# Altium schematic sheet 07-N100.SchDoc: KARGOBOT-TBOX-V2.0
size 513 x 386 mm; Page Create Date: March  8, 1995; Page Number: 4; Page Size: C; Page Count: 81; RevCode: A; DsnPath: C:\Users\Administrator\Desktop\123\KARGOBOT-TCU-ORIN-V1.1.DSN; SchematicName: KARGOBT-TCU-ORIN-V1.1; PageName: N100; PageSize: C; TopSchematic: True
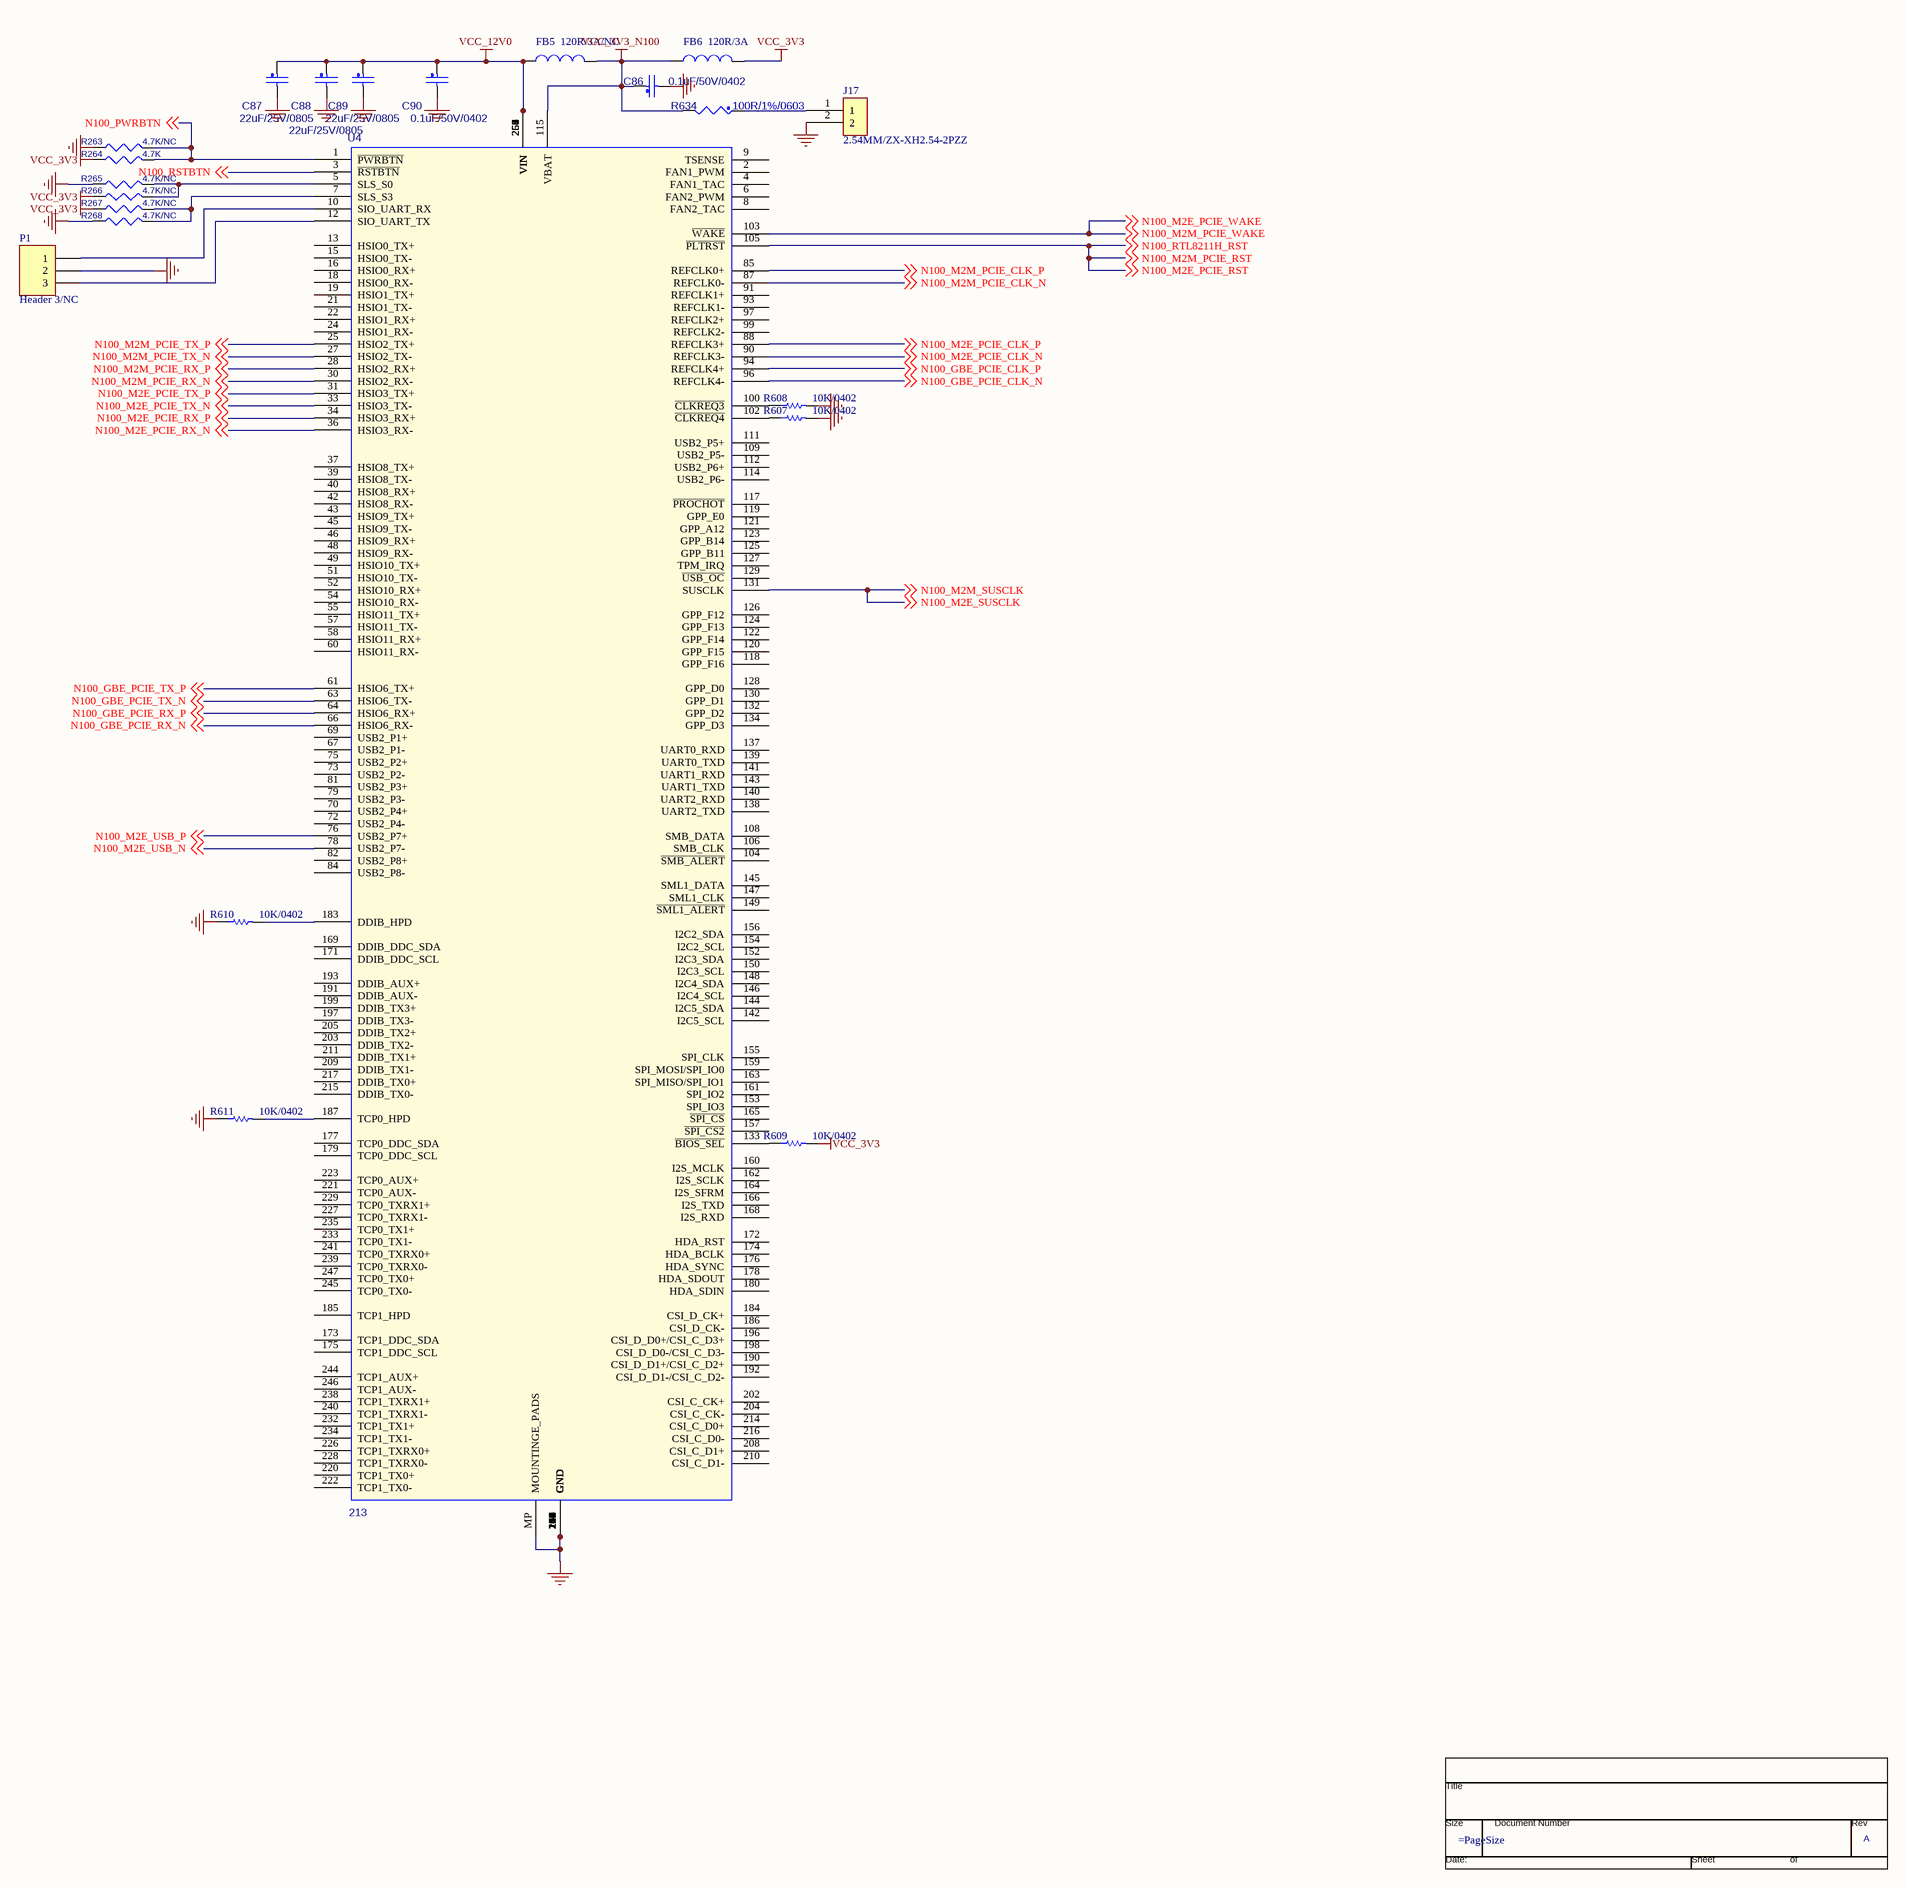
[diagram p0: 07-N100.SchDoc]

## Parts
*  RevCode: A  (graphical)
C86  value 0.1uF/50V/0402  [C0402]  (hidden comment: CAP_NP)
C87  value 22uF/25V/0805  [C0805]  (hidden comment: CAP_NP)
C88  value 22uF/25V/0805  [C0805]  (hidden comment: CAP_NP)
C89  value 22uF/25V/0805  [C0805]  (hidden comment: CAP_NP)
C90  value 0.1uF/50V/0402  [C0402]  (hidden comment: CAP_NP)
FB5  120R/3A/NC  [L0603]
FB6  120R/3A  [L0603]
J17  2.54MM/ZX-XH2.54-2PZZ  [CONN-TH_2P-P2.50_HX25003-2A]
P1  Header 3/NC  [HEADER3]
R263  value 4.7K/NC  [R0402]  (hidden comment: RESISTOR)
R264  value 4.7K  [R0402]  (hidden comment: RESISTOR)
R265  value 4.7K/NC  [R0402]  (hidden comment: RESISTOR)
R266  value 4.7K/NC  [R0402]  (hidden comment: RESISTOR)
R267  value 4.7K/NC  [R0402]  (hidden comment: RESISTOR)
R268  value 4.7K/NC  [R0402]  (hidden comment: RESISTOR)
R607  10K/0402  [R0402]
R608  10K/0402  [R0402]
R609  10K/0402  [R0402]
R610  10K/0402  [R0402]
R611  10K/0402  [R0402]
R634  value 100R/1%/0603  [R0603]  (hidden comment: RES_Dup2)
U4  value 213  [N100]  (hidden comment: N100)

## Nets
GND: C86.2 C87.2 C88.2 C89.2 C90.2 J17.2 P1.2 R263.1 R265.1 R268.1 R607.2 R608.2 R610.1 R611.1 U4.11(GND) U4.14(GND) U4.17(GND) U4.20(GND) U4.23(GND) U4.26(GND) U4.29(GND) U4.32(GND) U4.35(GND) U4.38(GND) U4.41(GND) U4.44(GND) U4.47(GND) U4.50(GND) U4.53(GND) U4.56(GND) U4.59(GND) U4.62(GND) U4.65(GND) U4.68(GND) U4.71(GND) U4.74(GND) U4.77(GND) U4.80(GND) U4.83(GND) U4.86(GND) U4.89(GND) U4.92(GND) U4.95(GND) U4.98(GND) U4.101(GND) U4.107(GND) U4.110(GND) U4.113(GND) U4.116(GND) U4.135(GND) U4.136(GND) U4.151(GND) U4.158(GND) U4.167(GND) U4.170(GND) U4.181(GND) U4.182(GND) U4.188(GND) U4.189(GND) U4.194(GND) U4.195(GND) U4.200(GND) U4.201(GND) U4.206(GND) U4.207(GND) U4.212(GND) U4.213(GND) U4.218(GND) U4.219(GND) U4.224(GND) U4.225(GND) U4.230(GND) U4.231(GND) U4.236(GND) U4.237(GND) U4.242(GND) U4.243(GND) U4.248(GND) U4.249(GND) U4.MP(MOUNTINGE_PADS)
VCC_3V3: FB6.2 R264.1 R266.1 R267.1 R609.2
VCC_3V3_N100: C86.1 FB5.2 FB6.1 R634.2 U4.115(VBAT)
VCC_12V0: C87.1 C88.1 C89.1 C90.1 FB5.1 U4.250(VIN) U4.251(VIN) U4.252(VIN) U4.253(VIN) U4.254(VIN) U4.255(VIN) U4.256(VIN) U4.257(VIN) U4.258(VIN) U4.259(VIN) U4.260(VIN)
N100_GBE_PCIE_CLK_N: U4.96(REFCLK4-) ; off-sheet N100_GBE_PCIE_CLK_N
N100_GBE_PCIE_CLK_P: U4.94(REFCLK4+) ; off-sheet N100_GBE_PCIE_CLK_P
N100_GBE_PCIE_RX_N: U4.66(HSIO6_RX-) ; off-sheet N100_GBE_PCIE_RX_N
N100_GBE_PCIE_RX_P: U4.64(HSIO6_RX+) ; off-sheet N100_GBE_PCIE_RX_P
N100_GBE_PCIE_TX_N: U4.63(HSIO6_TX-) ; off-sheet N100_GBE_PCIE_TX_N
N100_GBE_PCIE_TX_P: U4.61(HSIO6_TX+) ; off-sheet N100_GBE_PCIE_TX_P
N100_M2E_PCIE_CLK_N: U4.90(REFCLK3-) ; off-sheet N100_M2E_PCIE_CLK_N
N100_M2E_PCIE_CLK_P: U4.88(REFCLK3+) ; off-sheet N100_M2E_PCIE_CLK_P
N100_M2E_PCIE_RST: U4.105(~{PLTRST}) ; off-sheet N100_RTL8211H_RST, off-sheet N100_M2M_PCIE_RST, off-sheet N100_M2E_PCIE_RST  [also labelled N100_M2M_PCIE_RST, N100_RTL8211H_RST]
N100_M2E_PCIE_RX_N: U4.36(HSIO3_RX-) ; off-sheet N100_M2E_PCIE_RX_N
N100_M2E_PCIE_RX_P: U4.34(HSIO3_RX+) ; off-sheet N100_M2E_PCIE_RX_P
N100_M2E_PCIE_TX_N: U4.33(HSIO3_TX-) ; off-sheet N100_M2E_PCIE_TX_N
N100_M2E_PCIE_TX_P: U4.31(HSIO3_TX+) ; off-sheet N100_M2E_PCIE_TX_P
N100_M2E_PCIE_WAKE: U4.103(~{WAKE}) ; off-sheet N100_M2M_PCIE_WAKE, off-sheet N100_M2E_PCIE_WAKE  [also labelled N100_M2M_PCIE_WAKE]
N100_M2E_SUSCLK: U4.131(SUSCLK) ; off-sheet N100_M2M_SUSCLK, off-sheet N100_M2E_SUSCLK  [also labelled N100_M2M_SUSCLK]
N100_M2E_USB_N: U4.78(USB2_P7-) ; off-sheet N100_M2E_USB_N
N100_M2E_USB_P: U4.76(USB2_P7+) ; off-sheet N100_M2E_USB_P
N100_M2M_PCIE_CLK_N: U4.87(REFCLK0-) ; off-sheet N100_M2M_PCIE_CLK_N
N100_M2M_PCIE_CLK_P: U4.85(REFCLK0+) ; off-sheet N100_M2M_PCIE_CLK_P
N100_M2M_PCIE_RX_N: U4.30(HSIO2_RX-) ; off-sheet N100_M2M_PCIE_RX_N
N100_M2M_PCIE_RX_P: U4.28(HSIO2_RX+) ; off-sheet N100_M2M_PCIE_RX_P
N100_M2M_PCIE_TX_N: U4.27(HSIO2_TX-) ; off-sheet N100_M2M_PCIE_TX_N
N100_M2M_PCIE_TX_P: U4.25(HSIO2_TX+) ; off-sheet N100_M2M_PCIE_TX_P
N100_PWRBTN: R263.2 R264.2 U4.1(~{PWRBTN}) ; off-sheet N100_PWRBTN
N100_RSTBTN: U4.3(~{RSTBTN}) ; off-sheet N100_RSTBTN
NetJ17_1: J17.1 R634.1
NetP1_1: P1.1 U4.10(SIO_UART_RX)
NetP1_3: P1.3 U4.12(SIO_UART_TX)
NetR265_2: R265.2 R266.2 U4.5(SLS_S0)
NetR267_2: R267.2 R268.2 U4.7(SLS_S3)
NetR607_1: R607.1 U4.102(~{CLKREQ4})
NetR608_1: R608.1 U4.100(~{CLKREQ3})
NetR609_1: R609.1 U4.133(~{BIOS_SEL})
NetR610_2: R610.2 U4.183(DDIB_HPD)
NetR611_2: R611.2 U4.187(TCP0_HPD)

Not connected (* = marked no-connect by the designer): U4 2(FAN1_PWM) 4(FAN1_TAC) 6(FAN2_PWM) 8(FAN2_TAC) 9(TSENSE) 13(HSIO0_TX+) 15(HSIO0_TX-) 16(HSIO0_RX+) 18(HSIO0_RX-) 19(HSIO1_TX+) 21(HSIO1_TX-) 22(HSIO1_RX+) 24(HSIO1_RX-) 37(HSIO8_TX+) 39(HSIO8_TX-) 40(HSIO8_RX+) 42(HSIO8_RX-) 43(HSIO9_TX+) 45(HSIO9_TX-) 46(HSIO9_RX+) 48(HSIO9_RX-) 49(HSIO10_TX+) 51(HSIO10_TX-) 52(HSIO10_RX+) 54(HSIO10_RX-) 55(HSIO11_TX+) 57(HSIO11_TX-) 58(HSIO11_RX+) 60(HSIO11_RX-) 67(USB2_P1-) 69(USB2_P1+) 70(USB2_P4+) 72(USB2_P4-) 73(USB2_P2-) 75(USB2_P2+) 79(USB2_P3-) 81(USB2_P3+) 82(USB2_P8+) 84(USB2_P8-) 91(REFCLK1+) 93(REFCLK1-) 97(REFCLK2+) 99(REFCLK2-) 104(~{SMB_ALERT}) 106(SMB_CLK) 108(SMB_DATA) 109(USB2_P5-) 111(USB2_P5+) 112(USB2_P6+) 114(USB2_P6-) 117(~{PROCHOT}) 118(GPP_F16) 119(GPP_E0) 120(GPP_F15) 121(GPP_A12) 122(GPP_F14) 123(GPP_B14) 124(GPP_F13) 125(GPP_B11) 126(GPP_F12) 127(TPM_IRQ) 128(GPP_D0) 129(~{USB_OC}) 130(GPP_D1) 132(GPP_D2) 134(GPP_D3) 137(UART0_RXD) 138(UART2_TXD) 139(UART0_TXD) 140(UART2_RXD) 141(UART1_RXD) 142(I2C5_SCL) 143(UART1_TXD) 144(I2C5_SDA) 145(SML1_DATA) 146(I2C4_SCL) 147(SML1_CLK) 148(I2C4_SDA) 149(~{SML1_ALERT}) 150(I2C3_SCL) 152(I2C3_SDA) 153(SPI_IO3) 154(I2C2_SCL) 155(SPI_CLK) 156(I2C2_SDA) 157(~{SPI_CS2}) 159(SPI_MOSI/SPI_IO0) 160(I2S_MCLK) 161(SPI_IO2) 162(I2S_SCLK) 163(SPI_MISO/SPI_IO1) 164(I2S_SFRM) 165(~{SPI_CS}) 166(I2S_TXD) 168(I2S_RXD) 169(DDIB_DDC_SDA) 171(DDIB_DDC_SCL) 172(HDA_RST) 173(TCP1_DDC_SDA) 174(HDA_BCLK) 175(TCP1_DDC_SCL) 176(HDA_SYNC) 177(TCP0_DDC_SDA) 178(HDA_SDOUT) 179(TCP0_DDC_SCL) 180(HDA_SDIN) 184(CSI_D_CK+) 185(TCP1_HPD) 186(CSI_D_CK-) 190(CSI_D_D1+/CSI_C_D2+) 191(DDIB_AUX-) 192(CSI_D_D1-/CSI_C_D2-) 193(DDIB_AUX+) 196(CSI_D_D0+/CSI_C_D3+) 197(DDIB_TX3-) 198(CSI_D_D0-/CSI_C_D3-) 199(DDIB_TX3+) 202(CSI_C_CK+) 203(DDIB_TX2-) 204(CSI_C_CK-) 205(DDIB_TX2+) 208(CSI_C_D1+) 209(DDIB_TX1-) 210(CSI_C_D1-) 211(DDIB_TX1+) 214(CSI_C_D0+) 215(DDIB_TX0-) 216(CSI_C_D0-) 217(DDIB_TX0+) 220(TCP1_TX0+) 221(TCP0_AUX-) 222(TCP1_TX0-) 223(TCP0_AUX+) 226(TCP1_TXRX0+) 227(TCP0_TXRX1-) 228(TCP1_TXRX0-) 229(TCP0_TXRX1+) 232(TCP1_TX1+) 233(TCP0_TX1-) 234(TCP1_TX1-) 235(TCP0_TX1+) 238(TCP1_TXRX1+) 239(TCP0_TXRX0-) 240(TCP1_TXRX1-) 241(TCP0_TXRX0+) 244(TCP1_AUX+) 245(TCP0_TX0-) 246(TCP1_AUX-) 247(TCP0_TX0+)

## Notes on the sheet
- (in symbol TitleBlock0) Title; Size; Document Number; Rev; Date:; Sheet; of

## Library data of the parts
* = TitleBlock0: Page Count: 81; Page Number: 4; Title: KARGOBOT-TBOX-V2.0; Page Size: =PageSize; Page Create Date: March  8, 1995; Page Modify Date: =ModifiedDate
C86 C90 = CAP_NP: GCM155R71H104KE02/MURATA; Part Reference: C15; CLASS: DISCRETE; FPLIST: CC0402_25,CC0402_HD,CC0402_CC; CAD_APPROVED: Yes; MFG_PN01: 0402YC104KAT2A; MFG_NAME01: AVX; Tolerance: 10%; AGILE_PN: 150-75182; VOLTAGE: 16V; HEIGHT: 0.635MM; ROHS: Yes; TOL: 10%; PCB Footprint: C0402
C87-C89 = CAP_NP: GRT31CC71E226ME13/MURATA; Part Reference: C13; CLASS: DISCRETE; VOLTAGE: 10v; CAD_APPROVED: Yes; MFG_PN01: C1608X5R1A106K; MFG_NAME01: TDK; TOL: 10%; AGILE_PN: 150-78675; FPLIST: CC0603_OV,CC0603,0603_CC; PCB Footprint: C1206; HEIGHT: 1.016MM; ROHS: Yes; Tolerance: 10%
FB5 FB6 = Inductor: BLM18KG121TN1D; Code_IEC: 1005; Value: 10mH; Published: 8-Jun-2000; LatestRevisionDate: 29-May-2009; LatestRevisionNote: IPC-7351 Footprint Added.; PackageReference: 0402-A; Publisher: Altium Limited; PackageDescription: Chip Inductor; Code_JEITA: 0402
J17 = header2
P1 = Header 3: Header, 3-Pin; LatestRevisionDate: 17-Jul-2002; LatestRevisionNote: Re-released for DXP Platform.; Publisher: Altium Limited
R263-R268 = RESISTOR: Part Reference: R123; PCB Footprint: R0402
R607-R611 = Res Semi: Semiconductor Resistor; Value: 240R; Published: 8-Jun-2000; LatestRevisionDate: 17-Jul-2002; LatestRevisionNote: Re-released for DXP Platform.; PackageReference: AXIAL-0.5; Publisher: Altium Limited; PackageDescription: Axial Device, Thru-Hole; 2 Leads; 0.5 in Pin Spacing
R634 = RES_Dup2: AC0402FR-070RL/YAGEO; Part Reference: R97; CLASS: DISCRETE; SIGNAL_MODEL: DEFAULT_RESISTOR_33.000000OHM_2_1; FPLIST: RC0603_OV; CAD_APPROVED: Yes; MFG_PN01: CR-02FL6---33R; MFG_NAME01: YAGEO; Tolerance: 1%; AGILE_PN: 470-75790; TOL: 5%; PCB Footprint: R0402; ROHS: Yes; HEIGHT: 0.4MM
U4 = N100: Part Reference: U7